# Altium schematic sheet Communication_interfaces.SchDoc
size 420 x 297 mm; SheetNumber: 4
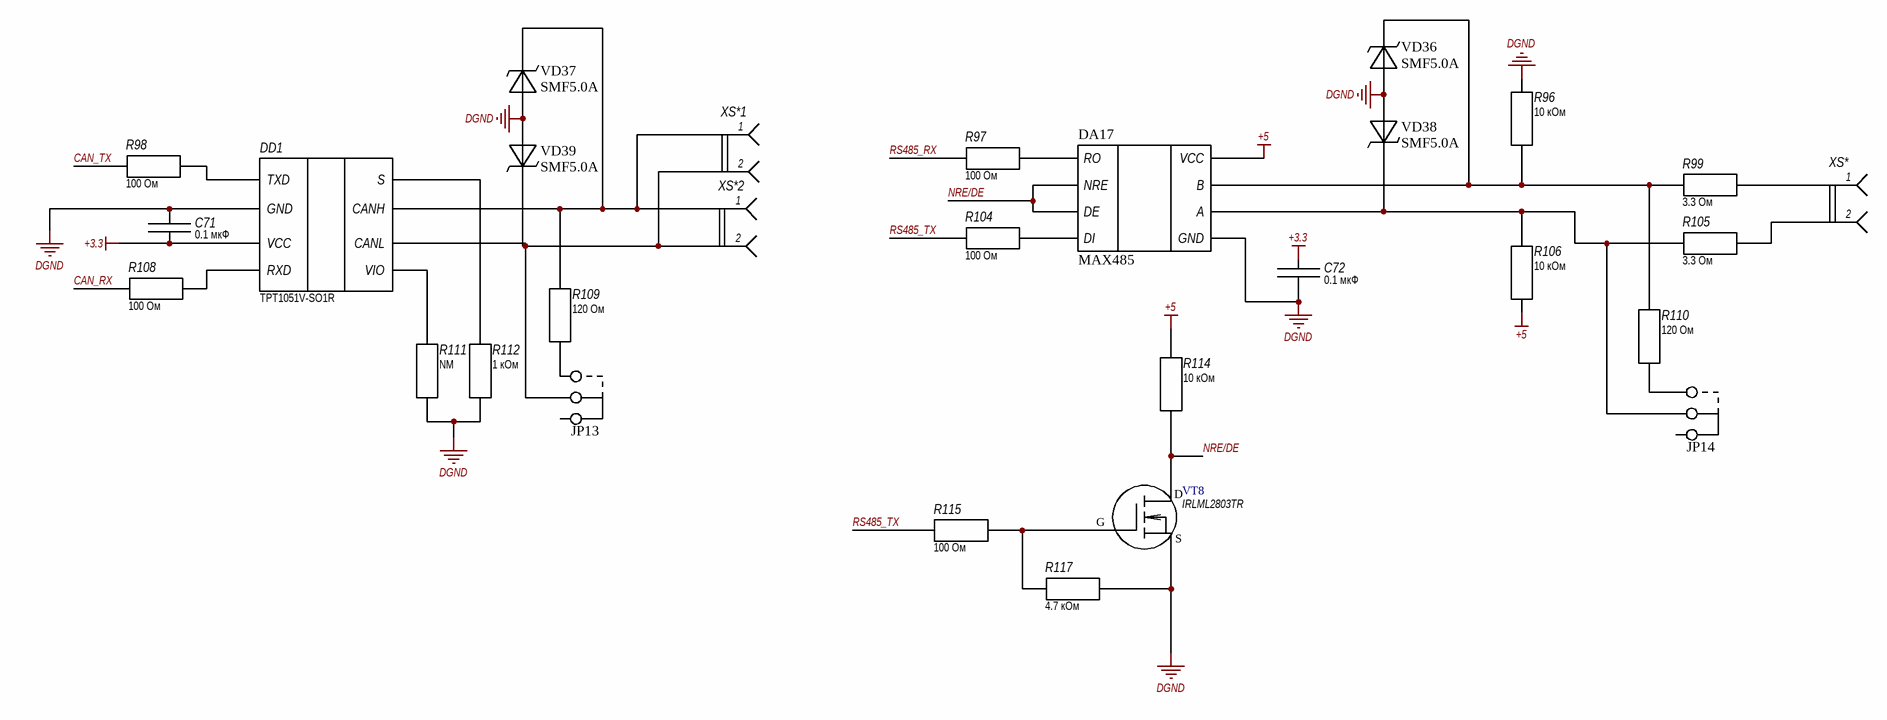
[diagram p0: Communication_interfaces.SchDoc]

## Parts
C71  value 0.1 мкФ  [CC0603]  (hidden comment: Capacitor)
C72  value 0.1 мкФ  [CC0603]  (hidden comment: Capacitor)
DA17  MAX485  [SO8]
DD1  TPT1051V-SO1R  [SO8]
JP13  Jumper  [PLS3]  (value not drawn)
JP14  Jumper  [PLS3]  (value not drawn)
R96  value 10 кОм  [RC0805]  (hidden comment: Resistor)
R97  value 100 Ом  [RC0603]  (hidden comment: Resistor)
R98  value 100 Ом  [RC0603]  (hidden comment: Resistor)
R99  value 3.3 Ом  [RC1206]  (hidden comment: Resistor)
R104  value 100 Ом  [RC0603]  (hidden comment: Resistor)
R105  value 3.3 Ом  [RC1206]  (hidden comment: Resistor)
R106  value 10 кОм  [RC0805]  (hidden comment: Resistor)
R108  value 100 Ом  [RC0603]  (hidden comment: Resistor)
R109  value 120 Ом  [RC1206]  (hidden comment: Resistor)
R110  value 120 Ом  [RC1206]  (hidden comment: Resistor)
R111  value NM  [RC0603]  (hidden comment: Resistor)
R112  value 1 кОм  [RC0603]  (hidden comment: Resistor)
R114  value 10 кОм  [RC0805]  (hidden comment: Resistor)
R115  value 100 Ом  [RC0603]  (hidden comment: Resistor)
R117  value 4.7 кОм  [RC0603]  (hidden comment: Resistor)
VD36  SMF5.0A  [D0-124AC]
VD37  SMF5.0A  [D0-124AC]
VD38  SMF5.0A  [D0-124AC]
VD39  SMF5.0A  [D0-124AC]
VT8  IRLML2803TR  [SOT-23-3]
XS*  DG141V-2.54-02P-14-00AH  [DG141V-2.54-02P]  (value not drawn)
XS*1  DG141V-2.54-02P-14-00AH  [DG141V-2.54-02P]  (value not drawn)
XS*2  DG141V-2.54-02P-14-00AH  [DG141V-2.54-02P]  (value not drawn)

## Nets
+3.3: C71.1 C72.2 DD1.3(VCC)
+5: DA17.5(VCC) R106.2 R114.1
DGND: C71.2 C72.1 DA17.8(GND) DD1.2(GND) R96.1 R111.2 R112.2 R117.1 VD36.A VD37.A VD38.A VD39.A VT8.S
CAN_RX: R108.2
CAN_TX: R98.2
NRE/DE: DA17.2(NRE) DA17.3(DE) R114.2 VT8.D
RS485_RX: R97.2
RS485_TX: R104.2 R115.2
NetDA17_1: DA17.1(RO) R97.1
NetDA17_4: DA17.4(DI) R104.1
NetDA17_6: DA17.6(B) R96.2 R99.1 R110.1 VD36.C
NetDA17_7: DA17.7(A) JP14.2 R105.1 R106.1 VD38.C
NetDD1_1: DD1.1(TXD) R98.1
NetDD1_4: DD1.4(RXD) R108.1
NetDD1_5: DD1.5(VIO) R111.1
NetDD1_6: DD1.6(CANL) JP13.2 VD39.C XS*1.2 XS*2.2
NetDD1_7: DD1.7(CANH) R109.1 VD37.C XS*1.1 XS*2.1
NetDD1_8: DD1.8(S) R112.1
NetJP13_1: JP13.1 R109.2
NetJP14_1: JP14.1 R110.2
NetR99_2: R99.2 XS*.1
NetR105_2: R105.2 XS*.2
NetR115_1: R115.1 R117.2 VT8.G

Not connected (* = marked no-connect by the designer): JP13 3(6); JP14 3(6)

## Notes on the sheet
- Подп. и дата
- Инв. № дубл.
- Взам. инв. №
- Инв. № подл.
- Изм.
- Лист
- № докум.
- Подп.
- Дата
- Форма 2а ГОСТ 2.104-2006
- Копировал
- Формат А3

## Library data of the parts
C71 C72 = Capacitor: Voltage: 16В; ComponentLink1Description: Product link; ComponentLink1URL: *; Name: CC0603; GOST_Name_1: =Name; GOST_Name_2: 16В; GOST_Name_3: 0.1 мкФ; GOST_Name_0: -
DA17 = MAX485ESA: GOST_Name_1: MAX485ESA+ ф. Maxim Integrated; ComponentLink1Description: Product link; ComponentLink1URL: https://www.platan.ru/cgi-bin/qwery.pl/id=355590810; Datasheet: https://doc.platan.ru/pdf/datasheets/maxim/MAX1487E-MAX491E-101921.pdf
DD1 = TPT1051V-SO1R: Физический уровень CAN; GOST_Name_1: TPT1051V-SO1R, ф. 3PEAK INCORPORATED; ComponentLink1Description: New link; ComponentLink1URL: https://www.chipdip.ru/product/max3051esa-maxim
R96 R106 R114 = Resistor: Power: 125 мВт; ComponentLink1Description: Product link; ComponentLink1URL: *; Name: RC0805; GOST_Name_1: =Name; GOST_Name_2: 125 мВт; GOST_Name_3: 10 кОм; GOST_Name_0: -
R97 R98 R104 R108 R111 R112 R115 R117 = Resistor: Power: 100 мВт; ComponentLink1Description: Product link; ComponentLink1URL: *; Name: RC0603; GOST_Name_1: =Name; GOST_Name_2: 100 мВт; GOST_Name_0: -
  R97 R98 R104 R108 R115: GOST_Name_3: 100 Ом
  R111: GOST_Name_3: NM
  R112: GOST_Name_3: 1 кОм
  R117: GOST_Name_3: 4.7 кОм
R99 R105 R109 R110 = Resistor: Power: 250 мВт; ComponentLink1Description: Product link; ComponentLink1URL: *; Name: RC1206; GOST_Name_1: =Name; GOST_Name_2: 250 мВт; GOST_Name_0: -
  R99 R105: GOST_Name_3: 3.3 Ом
  R109 R110: GOST_Name_3: 120 Ом
VD36-VD39 = TVS Diode: GOST_Name_1: SMF5.0A, Диод защитный 5В 200Вт; ComponentLink1Description: Product link
VT8 = N-MOSFET: pin to pad: D>3 G>1 S>2; GOST_Name_1: IRLML2803TR; ComponentLink1Description: Product link; ComponentLink1URL: https://www.chipdip.ru/product/irlml2803tr-umw?utm_source=direct&utm_medium=cpc&position_type=premium|k50id|010000005534644_5534644|cid|108406362|gid|5417216457|aid|15932497800|src|search_none&utm_campaign=Y_dinamicheskaya&utm_content=text1_ya&utm_term=&yclid=717148778588012543
XS* XS*1 XS*2 = DG141V-2.54-02P-14-00AH: GOST_Name_1: DG141V-2.54-02P-14-00AH, ф. Degson Electronics Co; ComponentLink1Description: Product link; ComponentLink1URL: https://www.promelec.ru/product/403282/
JP13 JP14 = Jumper: ComponentLink1Description: Product link; ComponentLink1URL: https://www.chipdip.ru/product/stps2h100a-2